# Altium schematic sheet EEPROM.SchDoc
size A4
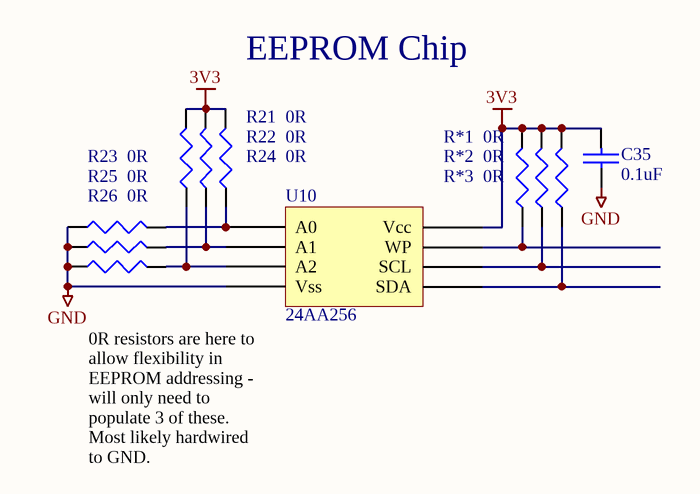
[diagram p0: EEPROM.SchDoc]

## Parts
C35  0.1uF  [0805]
R21  0R  [0603]
R22  0R  [0603]
R23  0R  [0603]
R24  0R  [0603]
R25  0R  [0603]
R26  0R  [0603]
R*1  0R  [0603]
R*2  0R  [0603]
R*3  0R  [0603]
U10  24AA256  [DIP8]

## Nets
3V3: C35.1 R21.2 R22.2 R24.2 R*1.2 R*2.2 R*3.2 U10.8(Vcc)
GND: C35.2 R23.1 R25.1 R26.1 U10.4(Vss)
NetR21_1: R21.1 R23.2 U10.1(A0)
NetR22_1: R22.1 R25.2 U10.2(A1)
NetR24_1: R24.1 R26.2 U10.3(A2)
NetR*1_1: R*1.1 U10.5(SDA)
NetR*2_1: R*2.1 U10.6(SCL)
NetR*3_1: R*3.1 U10.7(WP)

## Notes on the sheet
- EEPROM Chip
- 0R resistors are here to allow flexibility in EEPROM addressing - will only need to populate 3 of these. Most likely hardwired to GND.

## Library data of the parts
C35 = CAP: Capacitor; Order#: ??; Price: ??; Supplier: ??
R21-R26 R*1-R*3 = RES1: Resistor; Order#: 933-1697; Price: 0.11; Supplier: Farnell